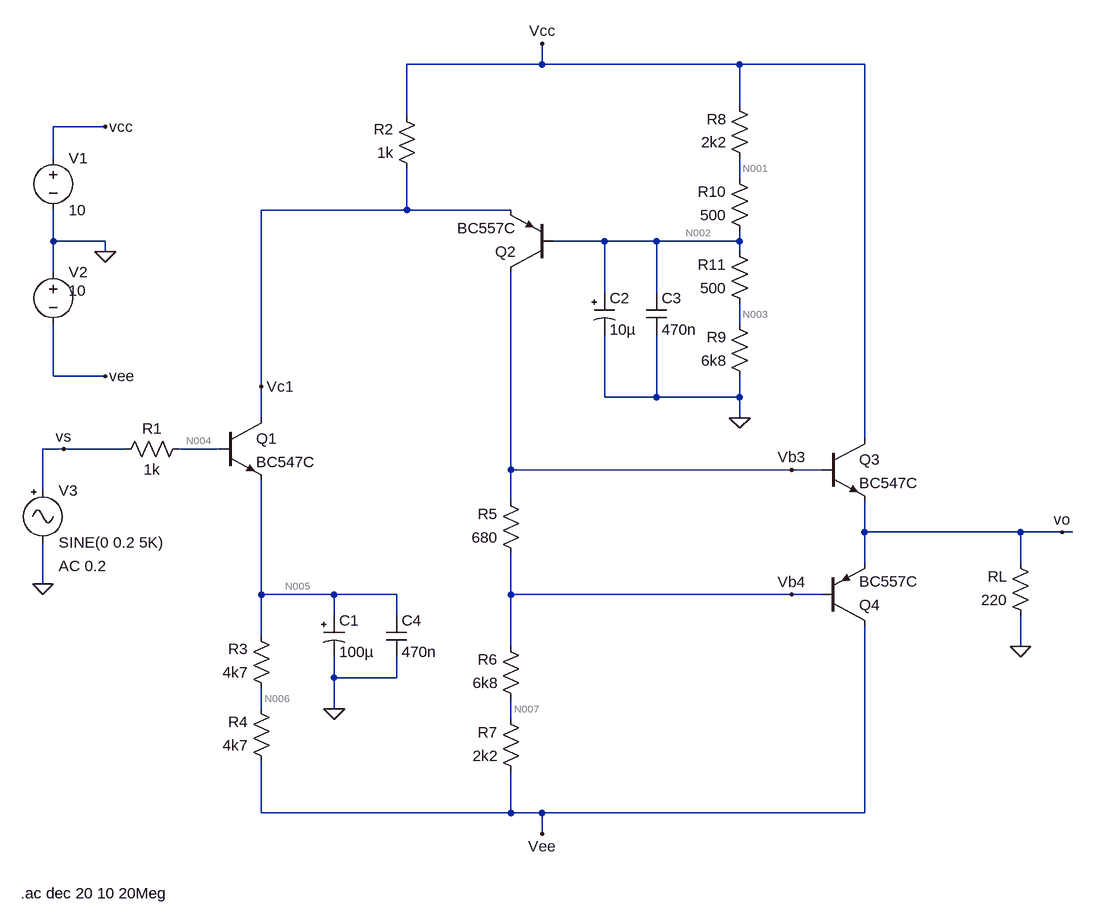
[diagram p0: schematic tp4-c1-1-2-ac.asc]
tp4-c1-1-2-ac.asc, the LTspice schematic file:
Version 4
SHEET 1 1760 876
WIRE 672 -464 672 -496
WIRE 672 -464 464 -464
WIRE 976 -464 672 -464
WIRE 1168 -464 976 -464
WIRE 976 -400 976 -464
WIRE 464 -384 464 -464
WIRE 0 -368 -80 -368
WIRE -80 -320 -80 -368
WIRE 976 -288 976 -320
WIRE 464 -240 464 -304
WIRE 464 -240 240 -240
WIRE 624 -240 464 -240
WIRE -80 -192 -80 -240
WIRE 0 -192 -80 -192
WIRE 768 -192 688 -192
WIRE 848 -192 768 -192
WIRE 976 -192 976 -208
WIRE 976 -192 848 -192
WIRE 0 -176 0 -192
WIRE 976 -176 976 -192
WIRE -80 -144 -80 -192
WIRE 768 -112 768 -192
WIRE 848 -112 848 -192
WIRE 624 160 624 -144
WIRE 976 -64 976 -96
WIRE -80 16 -80 -64
WIRE 0 16 -80 16
WIRE 240 32 240 -240
WIRE 768 48 768 -48
WIRE 848 48 848 -48
WIRE 848 48 768 48
WIRE 976 48 976 16
WIRE 976 48 848 48
WIRE 240 80 240 32
WIRE 976 80 976 48
WIRE 1168 112 1168 -464
WIRE -64 128 -96 128
WIRE 32 128 -64 128
WIRE 176 128 112 128
WIRE 1056 160 624 160
WIRE 1104 160 1056 160
WIRE -96 192 -96 128
WIRE 624 208 624 160
WIRE 1168 256 1168 208
WIRE 1408 256 1168 256
WIRE 1472 256 1408 256
WIRE 1488 256 1472 256
WIRE 1168 304 1168 256
WIRE 1408 304 1408 256
WIRE -96 336 -96 272
WIRE 240 352 240 176
WIRE 352 352 240 352
WIRE 448 352 352 352
WIRE 624 352 624 288
WIRE 1056 352 624 352
WIRE 1104 352 1056 352
WIRE 352 384 352 352
WIRE 448 384 448 352
WIRE 240 416 240 352
WIRE 624 432 624 352
WIRE 1408 432 1408 384
WIRE 352 480 352 448
WIRE 448 480 448 448
WIRE 448 480 352 480
WIRE 240 528 240 496
WIRE 352 528 352 480
WIRE 624 544 624 512
WIRE 240 688 240 608
WIRE 624 688 624 624
WIRE 624 688 240 688
WIRE 672 688 624 688
WIRE 1168 688 1168 400
WIRE 1168 688 672 688
WIRE 672 720 672 688
FLAG 1408 432 0
FLAG 352 528 0
FLAG 976 80 0
FLAG 0 -176 0
FLAG 0 16 vee
FLAG 0 -368 vcc
FLAG -96 336 0
FLAG 672 -496 Vcc
FLAG 1472 256 vo
FLAG -64 128 vs
FLAG 672 720 Vee
FLAG 240 32 Vc1
FLAG 1056 352 Vb4
FLAG 1056 160 Vb3
DATAFLAG 1344 256 "round(1000*$)/1000"
DATAFLAG 720 688 ""
DATAFLAG 720 -464 ""
DATAFLAG 848 -192 "round(1000*$)/1000"
DATAFLAG 368 -240 "round(1000*$)/1000"
DATAFLAG 784 160 "round(1000*$)/1000"
DATAFLAG 752 352 "round(1000*$)/1000"
DATAFLAG 240 272 "round(1000*$)/1000"
DATAFLAG 144 128 "round(1000*$)/1000"
DATAFLAG -16 128 ""
SYMBOL res 128 112 R90
WINDOW 0 0 56 VBottom 2
WINDOW 3 32 56 VTop 2
SYMATTR InstName R1
SYMATTR Value 1k
SYMBOL res 480 -288 R180
WINDOW 0 36 76 Left 2
WINDOW 3 36 40 Left 2
SYMATTR InstName R2
SYMATTR Value 1k
SYMBOL res 256 512 R180
WINDOW 0 36 76 Left 2
WINDOW 3 36 40 Left 2
SYMATTR InstName R3
SYMATTR Value 4k7
SYMBOL res 256 624 R180
WINDOW 0 36 76 Left 2
WINDOW 3 36 40 Left 2
SYMATTR InstName R4
SYMATTR Value 4k7
SYMBOL res 640 304 R180
WINDOW 0 36 76 Left 2
WINDOW 3 36 40 Left 2
SYMATTR InstName R5
SYMATTR Value 680
SYMBOL res 640 528 R180
WINDOW 0 36 76 Left 2
WINDOW 3 36 40 Left 2
SYMATTR InstName R6
SYMATTR Value 6k8
SYMBOL res 640 640 R180
WINDOW 0 36 76 Left 2
WINDOW 3 36 40 Left 2
SYMATTR InstName R7
SYMATTR Value 2k2
SYMBOL res 992 -304 R180
WINDOW 0 36 76 Left 2
WINDOW 3 36 40 Left 2
SYMATTR InstName R8
SYMATTR Value 2k2
SYMBOL res 992 32 R180
WINDOW 0 36 76 Left 2
WINDOW 3 36 40 Left 2
SYMATTR InstName R9
SYMATTR Value 6k8
SYMBOL res 992 -192 R180
WINDOW 0 36 76 Left 2
WINDOW 3 36 40 Left 2
SYMATTR InstName R10
SYMATTR Value 500
SYMBOL res 992 -80 R180
WINDOW 0 36 76 Left 2
WINDOW 3 36 40 Left 2
SYMATTR InstName R11
SYMATTR Value 500
SYMBOL res 1424 400 R180
WINDOW 0 36 76 Left 2
WINDOW 3 36 40 Left 2
SYMATTR InstName RL
SYMATTR Value 220
SYMBOL npn 176 80 R0
SYMATTR InstName Q1
SYMATTR Value BC547C
SYMBOL npn 1104 112 R0
SYMATTR InstName Q3
SYMATTR Value BC547C
SYMBOL pnp 688 -144 R180
SYMATTR InstName Q2
SYMATTR Value BC557C
SYMBOL pnp 1104 400 M180
SYMATTR InstName Q4
SYMATTR Value BC557C
SYMBOL polcap 336 384 R0
SYMATTR InstName C1
SYMATTR Value 100µ
SYMBOL polcap 752 -112 R0
SYMATTR InstName C2
SYMATTR Value 10µ
SYMBOL voltage -80 -336 R0
WINDOW 123 0 0 Left 0
WINDOW 39 0 0 Left 0
SYMATTR InstName V1
SYMATTR Value 10
SYMBOL voltage -80 -160 R0
WINDOW 3 24 44 Left 2
WINDOW 123 0 0 Left 0
WINDOW 39 0 0 Left 0
SYMATTR InstName V2
SYMATTR Value 10
SYMBOL Misc\\signal -96 176 R0
WINDOW 123 24 132 Left 2
WINDOW 39 0 0 Left 0
SYMATTR InstName V3
SYMATTR Value SINE(0 0.2 5K)
SYMATTR Value2 AC 0.2
SYMBOL cap 832 -112 R0
SYMATTR InstName C3
SYMATTR Value 470n
SYMBOL cap 432 384 R0
SYMATTR InstName C4
SYMATTR Value 470n
TEXT -130 812 Left 2 !.ac dec 20 10 20Meg

The netlist it stands for:
* tp4-c1-1-2-ac.asc
R1 N004 vs 1k
R2 Vc1 vcc 1k
R3 N006 N005 4k7
R4 vee N006 4k7
R5 Vb4 Vb3 680
R6 N007 Vb4 6k8
R7 vee N007 2k2
R8 N001 vcc 2k2
R9 0 N003 6k8
R10 N002 N001 500
R11 N003 N002 500
RL 0 vo 220
Q1 Vc1 N004 N005 0 BC547C
Q3 vcc Vb3 vo 0 BC547C
Q2 Vb3 N002 Vc1 0 BC557C
Q4 vee Vb4 vo 0 BC557C
C1 N005 0 100µ
C2 N002 0 10µ
V1 vcc 0 10
V2 0 vee 10
V3 vs 0 SINE(0 0.2 5K) AC 0.2
C3 N002 0 470n
C4 N005 0 470n
.model NPN NPN
.model PNP PNP
.lib standard.bjt
.ac dec 20 10 20Meg
.backanno
.end

* Results of the author's LTspice run, read from the files saved beside the schematic
* Operating Point, zero values left out:
*   V(n004) = -1.912 mV
*   V(vc1) = 7.918 V
*   V(vcc) = 10 V
*   V(n006) = -5.31 V
*   V(n005) = -620 mV
*   V(vee) = -10 V
*   V(vb4) = -239.9 mV
*   V(vb3) = 497.5 mV
*   V(n007) = -7.614 V
*   V(n001) = 7.803 V
*   V(n003) = 6.803 V
*   V(n002) = 7.304 V
*   V(vo) = 2.093 mV
*   Ic(Q4) = -841.6 pA
*   Ib(Q4) = 5.378 pA
*   Ie(Q4) = 836.2 pA
*   Ic(Q2) = -1.084 mA
*   Ib(Q2) = -1.894 µA
*   Ie(Q2) = 1.086 mA
*   Ic(Q3) = 9.495 µA
*   Ib(Q3) = 18.03 nA
*   Ie(Q3) = -9.513 µA
*   Ic(Q1) = 996 µA
*   Ib(Q1) = 1.912 µA
*   Ie(Q1) = -997.9 µA
*   I(Rl) = -9.512 µA
*   I(R11) = -1.001 mA
*   I(R10) = -998.6 µA
*   I(R9) = -1.001 mA
*   I(R8) = -998.6 µA
*   I(R7) = -1.084 mA
*   I(R6) = -1.084 mA
*   I(R5) = -1.084 mA
*   I(R4) = -997.9 µA
*   I(R3) = -997.9 µA
*   I(R2) = -2.082 mA
*   I(R1) = -1.912 µA
*   I(V3) = -1.912 µA
*   I(V2) = -2.082 mA
*   I(V1) = -3.09 mA
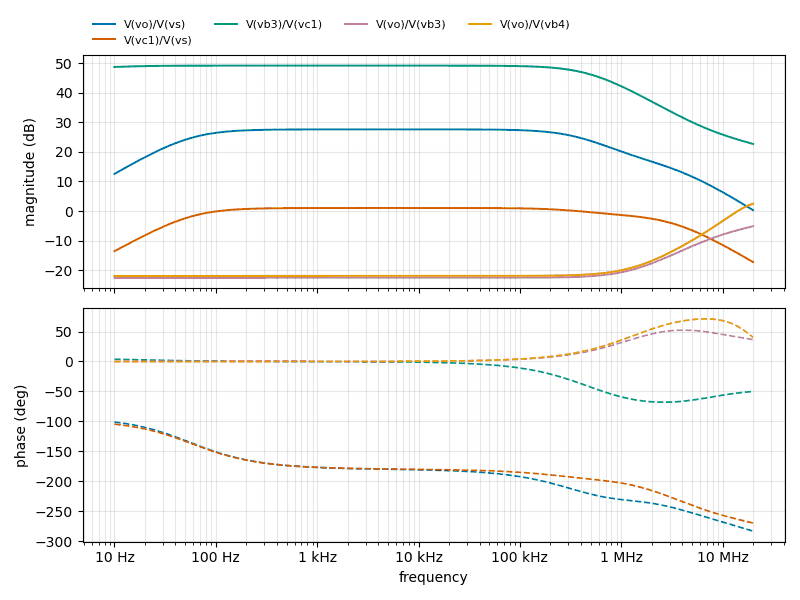
[diagram p1: AC Analysis of tp4-c1-1-2-ac.asc, plotted from the saved traces]
* AC Analysis, 1 run:
*   V(vo)/V(vs): 12.57 dB at 10 Hz, 0.28 dB at 20 MHz, peak 27.63 dB at 4.467 kHz, 3 dB below the peak at 55.69 Hz and 407.2 kHz
*   V(vc1)/V(vs): -13.58 dB at 10 Hz, -17.27 dB at 20 MHz, peak 1.03 dB at 5.623 kHz, 3 dB below the peak at 55.39 Hz and 1.511 MHz
*   V(vb3)/V(vc1): 48.74 dB at 10 Hz, 22.67 dB at 20 MHz, peak 49.20 dB at 1.413 kHz, 3 dB below the peak at 499.4 kHz
*   V(vo)/V(vb3): -22.60 dB at 10 Hz, -5.12 dB at 20 MHz, peak -5.12 dB at 20 MHz, 3 dB below the peak at 9.692 MHz
*   V(vo)/V(vb4): -21.97 dB at 10 Hz, 2.47 dB at 20 MHz, peak 2.47 dB at 20 MHz, 3 dB below the peak at 13.36 MHz